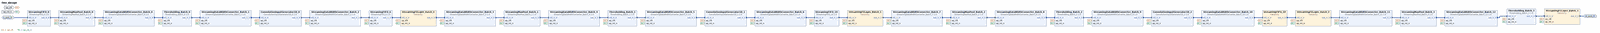
[diagram p0: block diagram of the top level, whole]
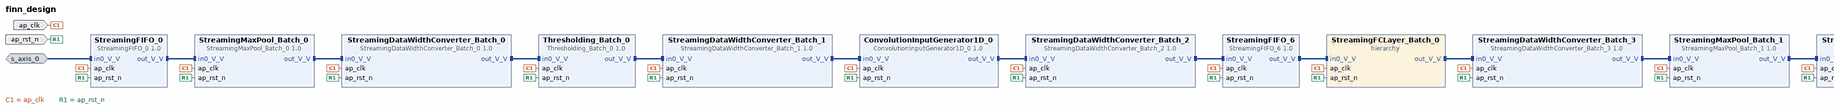
[diagram p1: block diagram of the top level, left part]
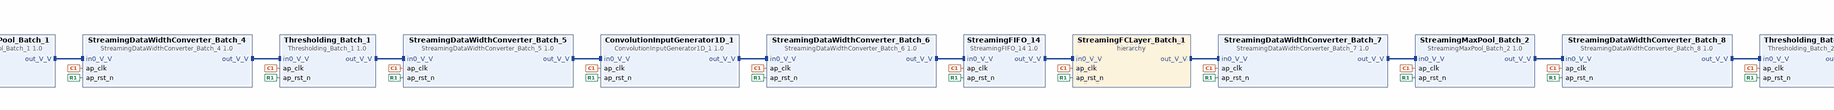
[diagram p2: block diagram of the top level, centre part]
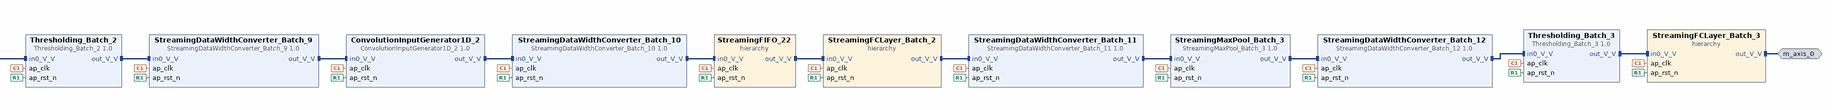
[diagram p3: block diagram of the top level, right part]
# Vivado block design finn_design, xc7z020clg400-1, Vivado 2019.1
create_bd_design finn_design

create_bd_intf_port -mode Slave -vlnv xilinx.com:interface:axis_rtl:1.0 s_axis_0
set_property -dict [list \
  CONFIG.FREQ_HZ 100000000.000000 \
  CONFIG.HAS_TKEEP 0 \
  CONFIG.HAS_TLAST 0 \
  CONFIG.HAS_TREADY 1 \
  CONFIG.HAS_TSTRB 0 \
  CONFIG.LAYERED_METADATA undef \
  CONFIG.TDATA_NUM_BYTES 25 \
  CONFIG.TDEST_WIDTH 0 \
  CONFIG.TID_WIDTH 0 \
  CONFIG.TUSER_WIDTH 0 \
] [get_bd_intf_ports s_axis_0]
create_bd_intf_port -mode Master -vlnv xilinx.com:interface:axis_rtl:1.0 m_axis_0
set_property -dict {CONFIG.FREQ_HZ 100000000.000000} [get_bd_intf_ports m_axis_0]
create_bd_port -dir I -type clk ap_clk
set_property -dict {CONFIG.FREQ_HZ 100000000.000000} [get_bd_ports ap_clk]
create_bd_port -dir I -type rst ap_rst_n

create_bd_cell -type ip -vlnv xilinx.com:hls:StreamingFIFO_0:1.0 StreamingFIFO_0
create_bd_cell -type ip -vlnv xilinx.com:hls:StreamingMaxPool_Batch_0:1.0 StreamingMaxPool_Batch_0
create_bd_cell -type ip -vlnv xilinx.com:hls:StreamingDataWidthConverter_Batch_0:1.0 StreamingDataWidthConverter_Batch_0
create_bd_cell -type ip -vlnv xilinx.com:hls:Thresholding_Batch_0:1.0 Thresholding_Batch_0
create_bd_cell -type ip -vlnv xilinx.com:hls:StreamingDataWidthConverter_Batch_1:1.0 StreamingDataWidthConverter_Batch_1
create_bd_cell -type ip -vlnv xilinx.com:hls:ConvolutionInputGenerator1D_0:1.0 ConvolutionInputGenerator1D_0
create_bd_cell -type ip -vlnv xilinx.com:hls:StreamingDataWidthConverter_Batch_2:1.0 StreamingDataWidthConverter_Batch_2
create_bd_cell -type ip -vlnv xilinx.com:hls:StreamingFIFO_6:1.0 StreamingFIFO_6
create_bd_cell -type hier StreamingFCLayer_Batch_0
create_bd_cell -type ip -vlnv xilinx.com:hls:StreamingDataWidthConverter_Batch_3:1.0 StreamingDataWidthConverter_Batch_3
create_bd_cell -type ip -vlnv xilinx.com:hls:StreamingMaxPool_Batch_1:1.0 StreamingMaxPool_Batch_1
create_bd_cell -type ip -vlnv xilinx.com:hls:StreamingDataWidthConverter_Batch_4:1.0 StreamingDataWidthConverter_Batch_4
create_bd_cell -type ip -vlnv xilinx.com:hls:Thresholding_Batch_1:1.0 Thresholding_Batch_1
create_bd_cell -type ip -vlnv xilinx.com:hls:StreamingDataWidthConverter_Batch_5:1.0 StreamingDataWidthConverter_Batch_5
create_bd_cell -type ip -vlnv xilinx.com:hls:ConvolutionInputGenerator1D_1:1.0 ConvolutionInputGenerator1D_1
create_bd_cell -type ip -vlnv xilinx.com:hls:StreamingDataWidthConverter_Batch_6:1.0 StreamingDataWidthConverter_Batch_6
create_bd_cell -type ip -vlnv xilinx.com:hls:StreamingFIFO_14:1.0 StreamingFIFO_14
create_bd_cell -type hier StreamingFCLayer_Batch_1
create_bd_cell -type ip -vlnv xilinx.com:hls:StreamingDataWidthConverter_Batch_7:1.0 StreamingDataWidthConverter_Batch_7
create_bd_cell -type ip -vlnv xilinx.com:hls:StreamingMaxPool_Batch_2:1.0 StreamingMaxPool_Batch_2
create_bd_cell -type ip -vlnv xilinx.com:hls:StreamingDataWidthConverter_Batch_8:1.0 StreamingDataWidthConverter_Batch_8
create_bd_cell -type ip -vlnv xilinx.com:hls:Thresholding_Batch_2:1.0 Thresholding_Batch_2
create_bd_cell -type ip -vlnv xilinx.com:hls:StreamingDataWidthConverter_Batch_9:1.0 StreamingDataWidthConverter_Batch_9
create_bd_cell -type ip -vlnv xilinx.com:hls:ConvolutionInputGenerator1D_2:1.0 ConvolutionInputGenerator1D_2
create_bd_cell -type ip -vlnv xilinx.com:hls:StreamingDataWidthConverter_Batch_10:1.0 StreamingDataWidthConverter_Batch_10
create_bd_cell -type hier StreamingFIFO_22
create_bd_cell -type hier StreamingFCLayer_Batch_2
create_bd_cell -type ip -vlnv xilinx.com:hls:StreamingDataWidthConverter_Batch_11:1.0 StreamingDataWidthConverter_Batch_11
create_bd_cell -type ip -vlnv xilinx.com:hls:StreamingMaxPool_Batch_3:1.0 StreamingMaxPool_Batch_3
create_bd_cell -type ip -vlnv xilinx.com:hls:StreamingDataWidthConverter_Batch_12:1.0 StreamingDataWidthConverter_Batch_12
create_bd_cell -type ip -vlnv xilinx.com:hls:Thresholding_Batch_3:1.0 Thresholding_Batch_3
create_bd_cell -type hier StreamingFCLayer_Batch_3

# ---- hierarchy /StreamingFCLayer_Batch_0 ----
current_bd_instance /StreamingFCLayer_Batch_0
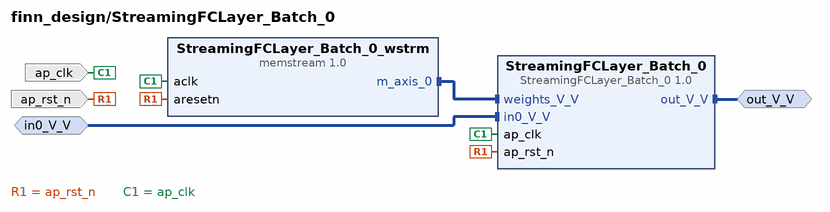
[diagram p4: block diagram inside /StreamingFCLayer_Batch_0]
create_bd_intf_pin -mode Master -vlnv xilinx.com:interface:axis_rtl:1.0 out_V_V
create_bd_intf_pin -mode Slave -vlnv xilinx.com:interface:axis_rtl:1.0 in0_V_V
create_bd_pin -dir I -type clk ap_clk
create_bd_pin -dir I -type rst ap_rst_n

create_bd_cell -type ip -vlnv xilinx.com:hls:StreamingFCLayer_Batch_0:1.0 StreamingFCLayer_Batch_0
create_bd_cell -type ip -vlnv xilinx.com:user:memstream:1.0 StreamingFCLayer_Batch_0_wstrm
set_property -dict [list \
  CONFIG.MEM_DEPTH 250 \
  CONFIG.MEM_INIT {/tmp/finn_dev_floodd1@ad.mee.tcd.ie/code_gen_ipgen_StreamingFCLayer_Batch_0_yrzn1xqf/} \
  CONFIG.MEM_WIDTH 360 \
  CONFIG.NSTREAMS 1 \
  CONFIG.RAM_STYLE auto \
  CONFIG.STRM0_DEPTH 250 \
  CONFIG.STRM0_OFFSET 0 \
  CONFIG.STRM0_WIDTH 360 \
] [get_bd_cells StreamingFCLayer_Batch_0_wstrm]

# ---- hierarchy /StreamingFCLayer_Batch_1 ----
current_bd_instance /StreamingFCLayer_Batch_1
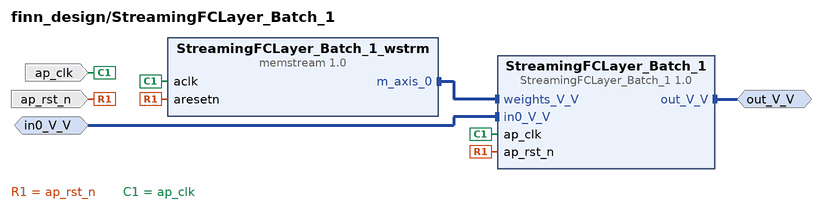
[diagram p5: block diagram inside /StreamingFCLayer_Batch_1]
create_bd_intf_pin -mode Master -vlnv xilinx.com:interface:axis_rtl:1.0 out_V_V
create_bd_intf_pin -mode Slave -vlnv xilinx.com:interface:axis_rtl:1.0 in0_V_V
create_bd_pin -dir I -type clk ap_clk
create_bd_pin -dir I -type rst ap_rst_n

create_bd_cell -type ip -vlnv xilinx.com:hls:StreamingFCLayer_Batch_1:1.0 StreamingFCLayer_Batch_1
create_bd_cell -type ip -vlnv xilinx.com:user:memstream:1.0 StreamingFCLayer_Batch_1_wstrm
set_property -dict [list \
  CONFIG.MEM_DEPTH 1125 \
  CONFIG.MEM_INIT {/tmp/finn_dev_floodd1@ad.mee.tcd.ie/code_gen_ipgen_StreamingFCLayer_Batch_1_5eper8a6/} \
  CONFIG.MEM_WIDTH 320 \
  CONFIG.NSTREAMS 1 \
  CONFIG.RAM_STYLE auto \
  CONFIG.STRM0_DEPTH 1125 \
  CONFIG.STRM0_OFFSET 0 \
  CONFIG.STRM0_WIDTH 320 \
] [get_bd_cells StreamingFCLayer_Batch_1_wstrm]

# ---- hierarchy /StreamingFIFO_22 ----
current_bd_instance /StreamingFIFO_22
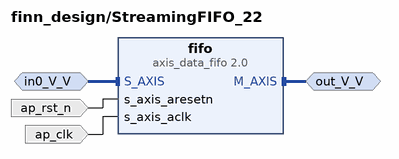
[diagram p6: block diagram inside /StreamingFIFO_22]
create_bd_intf_pin -mode Master -vlnv xilinx.com:interface:axis_rtl:1.0 out_V_V
create_bd_intf_pin -mode Slave -vlnv xilinx.com:interface:axis_rtl:1.0 in0_V_V
create_bd_pin -dir I -type clk ap_clk
create_bd_pin -dir I -type rst ap_rst_n

create_bd_cell -type ip -vlnv xilinx.com:ip:axis_data_fifo:2.0 fifo
set_property -dict {CONFIG.FIFO_DEPTH 512 CONFIG.FIFO_MEMORY_TYPE auto CONFIG.TDATA_NUM_BYTES 10} [get_bd_cells fifo]

# ---- hierarchy /StreamingFCLayer_Batch_2 ----
current_bd_instance /StreamingFCLayer_Batch_2
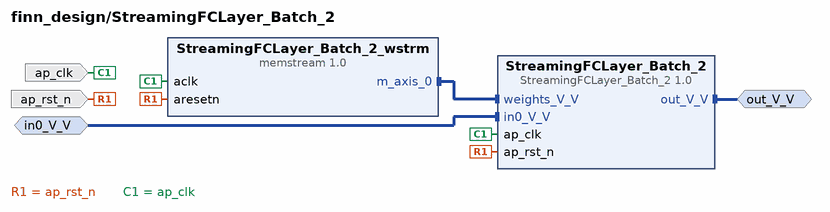
[diagram p7: block diagram inside /StreamingFCLayer_Batch_2]
create_bd_intf_pin -mode Master -vlnv xilinx.com:interface:axis_rtl:1.0 out_V_V
create_bd_intf_pin -mode Slave -vlnv xilinx.com:interface:axis_rtl:1.0 in0_V_V
create_bd_pin -dir I -type clk ap_clk
create_bd_pin -dir I -type rst ap_rst_n

create_bd_cell -type ip -vlnv xilinx.com:hls:StreamingFCLayer_Batch_2:1.0 StreamingFCLayer_Batch_2
create_bd_cell -type ip -vlnv xilinx.com:user:memstream:1.0 StreamingFCLayer_Batch_2_wstrm
set_property -dict [list \
  CONFIG.MEM_DEPTH 18000 \
  CONFIG.MEM_INIT {/tmp/finn_dev_floodd1@ad.mee.tcd.ie/code_gen_ipgen_StreamingFCLayer_Batch_2_8uay9h4c/} \
  CONFIG.MEM_WIDTH 80 \
  CONFIG.NSTREAMS 1 \
  CONFIG.RAM_STYLE auto \
  CONFIG.STRM0_DEPTH 18000 \
  CONFIG.STRM0_OFFSET 0 \
  CONFIG.STRM0_WIDTH 80 \
] [get_bd_cells StreamingFCLayer_Batch_2_wstrm]

# ---- hierarchy /StreamingFCLayer_Batch_3 ----
current_bd_instance /StreamingFCLayer_Batch_3
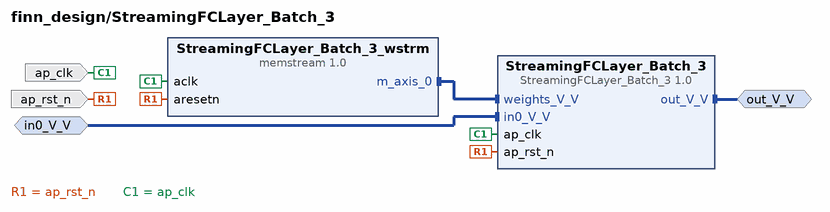
[diagram p8: block diagram inside /StreamingFCLayer_Batch_3]
create_bd_intf_pin -mode Master -vlnv xilinx.com:interface:axis_rtl:1.0 out_V_V
create_bd_intf_pin -mode Slave -vlnv xilinx.com:interface:axis_rtl:1.0 in0_V_V
create_bd_pin -dir I -type clk ap_clk
create_bd_pin -dir I -type rst ap_rst_n

create_bd_cell -type ip -vlnv xilinx.com:hls:StreamingFCLayer_Batch_3:1.0 StreamingFCLayer_Batch_3
create_bd_cell -type ip -vlnv xilinx.com:user:memstream:1.0 StreamingFCLayer_Batch_3_wstrm
set_property -dict [list \
  CONFIG.MEM_DEPTH 200 \
  CONFIG.MEM_INIT {/tmp/finn_dev_floodd1@ad.mee.tcd.ie/code_gen_ipgen_StreamingFCLayer_Batch_3_cpz_29h1/} \
  CONFIG.MEM_WIDTH 8 \
  CONFIG.NSTREAMS 1 \
  CONFIG.RAM_STYLE auto \
  CONFIG.STRM0_DEPTH 200 \
  CONFIG.STRM0_OFFSET 0 \
  CONFIG.STRM0_WIDTH 8 \
] [get_bd_cells StreamingFCLayer_Batch_3_wstrm]

# ---- connections ----

current_bd_instance /StreamingFCLayer_Batch_0
connect_bd_intf_net [get_bd_intf_pins StreamingFCLayer_Batch_0_wstrm/m_axis_0] [get_bd_intf_pins StreamingFCLayer_Batch_0/weights_V_V]
connect_bd_intf_net [get_bd_intf_pins out_V_V] [get_bd_intf_pins StreamingFCLayer_Batch_0/out_V_V]
connect_bd_intf_net [get_bd_intf_pins in0_V_V] [get_bd_intf_pins StreamingFCLayer_Batch_0/in0_V_V]
connect_bd_net [get_bd_pins ap_rst_n] [get_bd_pins StreamingFCLayer_Batch_0_wstrm/aresetn] [get_bd_pins StreamingFCLayer_Batch_0/ap_rst_n]
connect_bd_net [get_bd_pins ap_clk] [get_bd_pins StreamingFCLayer_Batch_0_wstrm/aclk] [get_bd_pins StreamingFCLayer_Batch_0/ap_clk]

current_bd_instance /StreamingFCLayer_Batch_1
connect_bd_intf_net [get_bd_intf_pins StreamingFCLayer_Batch_1_wstrm/m_axis_0] [get_bd_intf_pins StreamingFCLayer_Batch_1/weights_V_V]
connect_bd_intf_net [get_bd_intf_pins in0_V_V] [get_bd_intf_pins StreamingFCLayer_Batch_1/in0_V_V]
connect_bd_intf_net [get_bd_intf_pins out_V_V] [get_bd_intf_pins StreamingFCLayer_Batch_1/out_V_V]
connect_bd_net [get_bd_pins ap_rst_n] [get_bd_pins StreamingFCLayer_Batch_1_wstrm/aresetn] [get_bd_pins StreamingFCLayer_Batch_1/ap_rst_n]
connect_bd_net [get_bd_pins ap_clk] [get_bd_pins StreamingFCLayer_Batch_1_wstrm/aclk] [get_bd_pins StreamingFCLayer_Batch_1/ap_clk]

current_bd_instance /StreamingFIFO_22
connect_bd_intf_net [get_bd_intf_pins in0_V_V] [get_bd_intf_pins fifo/S_AXIS]
connect_bd_intf_net [get_bd_intf_pins out_V_V] [get_bd_intf_pins fifo/M_AXIS]
connect_bd_net [get_bd_pins ap_rst_n] [get_bd_pins fifo/s_axis_aresetn]
connect_bd_net [get_bd_pins ap_clk] [get_bd_pins fifo/s_axis_aclk]

current_bd_instance /StreamingFCLayer_Batch_2
connect_bd_intf_net [get_bd_intf_pins StreamingFCLayer_Batch_2_wstrm/m_axis_0] [get_bd_intf_pins StreamingFCLayer_Batch_2/weights_V_V]
connect_bd_intf_net [get_bd_intf_pins in0_V_V] [get_bd_intf_pins StreamingFCLayer_Batch_2/in0_V_V]
connect_bd_intf_net [get_bd_intf_pins out_V_V] [get_bd_intf_pins StreamingFCLayer_Batch_2/out_V_V]
connect_bd_net [get_bd_pins ap_rst_n] [get_bd_pins StreamingFCLayer_Batch_2_wstrm/aresetn] [get_bd_pins StreamingFCLayer_Batch_2/ap_rst_n]
connect_bd_net [get_bd_pins ap_clk] [get_bd_pins StreamingFCLayer_Batch_2_wstrm/aclk] [get_bd_pins StreamingFCLayer_Batch_2/ap_clk]

current_bd_instance /StreamingFCLayer_Batch_3
connect_bd_intf_net [get_bd_intf_pins StreamingFCLayer_Batch_3_wstrm/m_axis_0] [get_bd_intf_pins StreamingFCLayer_Batch_3/weights_V_V]
connect_bd_intf_net [get_bd_intf_pins in0_V_V] [get_bd_intf_pins StreamingFCLayer_Batch_3/in0_V_V]
connect_bd_intf_net [get_bd_intf_pins out_V_V] [get_bd_intf_pins StreamingFCLayer_Batch_3/out_V_V]
connect_bd_net [get_bd_pins ap_rst_n] [get_bd_pins StreamingFCLayer_Batch_3_wstrm/aresetn] [get_bd_pins StreamingFCLayer_Batch_3/ap_rst_n]
connect_bd_net [get_bd_pins ap_clk] [get_bd_pins StreamingFCLayer_Batch_3_wstrm/aclk] [get_bd_pins StreamingFCLayer_Batch_3/ap_clk]

current_bd_instance /
connect_bd_intf_net [get_bd_intf_pins StreamingDataWidthConverter_Batch_3/out_V_V] [get_bd_intf_pins StreamingMaxPool_Batch_1/in0_V_V]
connect_bd_intf_net [get_bd_intf_pins StreamingMaxPool_Batch_1/out_V_V] [get_bd_intf_pins StreamingDataWidthConverter_Batch_4/in0_V_V]
connect_bd_intf_net [get_bd_intf_pins Thresholding_Batch_1/out_V_V] [get_bd_intf_pins StreamingDataWidthConverter_Batch_5/in0_V_V]
connect_bd_intf_net [get_bd_intf_pins StreamingDataWidthConverter_Batch_7/out_V_V] [get_bd_intf_pins StreamingMaxPool_Batch_2/in0_V_V]
connect_bd_intf_net [get_bd_intf_pins StreamingDataWidthConverter_Batch_9/out_V_V] [get_bd_intf_pins ConvolutionInputGenerator1D_2/in0_V_V]
connect_bd_intf_net [get_bd_intf_pins StreamingFCLayer_Batch_2/out_V_V] [get_bd_intf_pins StreamingDataWidthConverter_Batch_11/in0_V_V]
connect_bd_intf_net [get_bd_intf_pins Thresholding_Batch_2/out_V_V] [get_bd_intf_pins StreamingDataWidthConverter_Batch_9/in0_V_V]
connect_bd_intf_net [get_bd_intf_pins StreamingFIFO_22/out_V_V] [get_bd_intf_pins StreamingFCLayer_Batch_2/in0_V_V]
connect_bd_intf_net [get_bd_intf_pins StreamingDataWidthConverter_Batch_2/out_V_V] [get_bd_intf_pins StreamingFIFO_6/in0_V_V]
connect_bd_intf_net [get_bd_intf_pins StreamingDataWidthConverter_Batch_12/out_V_V] [get_bd_intf_pins Thresholding_Batch_3/in0_V_V]
connect_bd_intf_net [get_bd_intf_pins StreamingDataWidthConverter_Batch_1/out_V_V] [get_bd_intf_pins ConvolutionInputGenerator1D_0/in0_V_V]
connect_bd_intf_net [get_bd_intf_pins Thresholding_Batch_0/out_V_V] [get_bd_intf_pins StreamingDataWidthConverter_Batch_1/in0_V_V]
connect_bd_intf_net [get_bd_intf_pins StreamingDataWidthConverter_Batch_4/out_V_V] [get_bd_intf_pins Thresholding_Batch_1/in0_V_V]
connect_bd_intf_net [get_bd_intf_pins StreamingDataWidthConverter_Batch_5/out_V_V] [get_bd_intf_pins ConvolutionInputGenerator1D_1/in0_V_V]
connect_bd_intf_net [get_bd_intf_pins StreamingFIFO_0/out_V_V] [get_bd_intf_pins StreamingMaxPool_Batch_0/in0_V_V]
connect_bd_intf_net [get_bd_intf_pins StreamingFCLayer_Batch_1/out_V_V] [get_bd_intf_pins StreamingDataWidthConverter_Batch_7/in0_V_V]
connect_bd_intf_net [get_bd_intf_pins ConvolutionInputGenerator1D_2/out_V_V] [get_bd_intf_pins StreamingDataWidthConverter_Batch_10/in0_V_V]
connect_bd_intf_net [get_bd_intf_pins StreamingFCLayer_Batch_0/out_V_V] [get_bd_intf_pins StreamingDataWidthConverter_Batch_3/in0_V_V]
connect_bd_intf_net [get_bd_intf_pins StreamingDataWidthConverter_Batch_10/out_V_V] [get_bd_intf_pins StreamingFIFO_22/in0_V_V]
connect_bd_intf_net [get_bd_intf_pins StreamingDataWidthConverter_Batch_8/out_V_V] [get_bd_intf_pins Thresholding_Batch_2/in0_V_V]
connect_bd_intf_net [get_bd_intf_pins StreamingFIFO_6/out_V_V] [get_bd_intf_pins StreamingFCLayer_Batch_0/in0_V_V]
connect_bd_intf_net [get_bd_intf_pins StreamingDataWidthConverter_Batch_11/out_V_V] [get_bd_intf_pins StreamingMaxPool_Batch_3/in0_V_V]
connect_bd_intf_net [get_bd_intf_ports m_axis_0] [get_bd_intf_pins StreamingFCLayer_Batch_3/out_V_V]
connect_bd_intf_net [get_bd_intf_pins StreamingDataWidthConverter_Batch_6/out_V_V] [get_bd_intf_pins StreamingFIFO_14/in0_V_V]
connect_bd_intf_net [get_bd_intf_pins ConvolutionInputGenerator1D_0/out_V_V] [get_bd_intf_pins StreamingDataWidthConverter_Batch_2/in0_V_V]
connect_bd_intf_net [get_bd_intf_pins StreamingMaxPool_Batch_2/out_V_V] [get_bd_intf_pins StreamingDataWidthConverter_Batch_8/in0_V_V]
connect_bd_intf_net [get_bd_intf_pins StreamingMaxPool_Batch_0/out_V_V] [get_bd_intf_pins StreamingDataWidthConverter_Batch_0/in0_V_V]
connect_bd_intf_net [get_bd_intf_pins Thresholding_Batch_3/out_V_V] [get_bd_intf_pins StreamingFCLayer_Batch_3/in0_V_V]
connect_bd_intf_net [get_bd_intf_pins StreamingDataWidthConverter_Batch_0/out_V_V] [get_bd_intf_pins Thresholding_Batch_0/in0_V_V]
connect_bd_intf_net [get_bd_intf_pins StreamingMaxPool_Batch_3/out_V_V] [get_bd_intf_pins StreamingDataWidthConverter_Batch_12/in0_V_V]
connect_bd_intf_net [get_bd_intf_pins ConvolutionInputGenerator1D_1/out_V_V] [get_bd_intf_pins StreamingDataWidthConverter_Batch_6/in0_V_V]
connect_bd_intf_net -intf_net in0_V_V_0_1 [get_bd_intf_ports s_axis_0] [get_bd_intf_pins StreamingFIFO_0/in0_V_V]
connect_bd_intf_net [get_bd_intf_pins StreamingFIFO_14/out_V_V] [get_bd_intf_pins StreamingFCLayer_Batch_1/in0_V_V]
connect_bd_net -net ap_clk_0_1 [get_bd_ports ap_clk] \
  [get_bd_pins StreamingFIFO_0/ap_clk] [get_bd_pins StreamingMaxPool_Batch_0/ap_clk] \
  [get_bd_pins StreamingDataWidthConverter_Batch_0/ap_clk] [get_bd_pins Thresholding_Batch_0/ap_clk] \
  [get_bd_pins StreamingDataWidthConverter_Batch_1/ap_clk] [get_bd_pins ConvolutionInputGenerator1D_0/ap_clk] \
  [get_bd_pins StreamingDataWidthConverter_Batch_2/ap_clk] [get_bd_pins StreamingFIFO_6/ap_clk] \
  [get_bd_pins StreamingFCLayer_Batch_0/ap_clk] [get_bd_pins StreamingDataWidthConverter_Batch_3/ap_clk] \
  [get_bd_pins StreamingMaxPool_Batch_1/ap_clk] [get_bd_pins StreamingDataWidthConverter_Batch_4/ap_clk] \
  [get_bd_pins Thresholding_Batch_1/ap_clk] [get_bd_pins StreamingDataWidthConverter_Batch_5/ap_clk] \
  [get_bd_pins ConvolutionInputGenerator1D_1/ap_clk] [get_bd_pins StreamingDataWidthConverter_Batch_6/ap_clk] \
  [get_bd_pins StreamingFIFO_14/ap_clk] [get_bd_pins StreamingFCLayer_Batch_1/ap_clk] \
  [get_bd_pins StreamingDataWidthConverter_Batch_7/ap_clk] [get_bd_pins StreamingMaxPool_Batch_2/ap_clk] \
  [get_bd_pins StreamingDataWidthConverter_Batch_8/ap_clk] [get_bd_pins Thresholding_Batch_2/ap_clk] \
  [get_bd_pins StreamingDataWidthConverter_Batch_9/ap_clk] [get_bd_pins ConvolutionInputGenerator1D_2/ap_clk] \
  [get_bd_pins StreamingDataWidthConverter_Batch_10/ap_clk] [get_bd_pins StreamingFIFO_22/ap_clk] \
  [get_bd_pins StreamingFCLayer_Batch_2/ap_clk] [get_bd_pins StreamingDataWidthConverter_Batch_11/ap_clk] \
  [get_bd_pins StreamingMaxPool_Batch_3/ap_clk] [get_bd_pins StreamingDataWidthConverter_Batch_12/ap_clk] \
  [get_bd_pins Thresholding_Batch_3/ap_clk] [get_bd_pins StreamingFCLayer_Batch_3/ap_clk]
connect_bd_net -net ap_rst_n_0_1 [get_bd_ports ap_rst_n] \
  [get_bd_pins StreamingFIFO_0/ap_rst_n] [get_bd_pins StreamingMaxPool_Batch_0/ap_rst_n] \
  [get_bd_pins StreamingDataWidthConverter_Batch_0/ap_rst_n] [get_bd_pins Thresholding_Batch_0/ap_rst_n] \
  [get_bd_pins StreamingDataWidthConverter_Batch_1/ap_rst_n] [get_bd_pins ConvolutionInputGenerator1D_0/ap_rst_n] \
  [get_bd_pins StreamingDataWidthConverter_Batch_2/ap_rst_n] [get_bd_pins StreamingFIFO_6/ap_rst_n] \
  [get_bd_pins StreamingFCLayer_Batch_0/ap_rst_n] [get_bd_pins StreamingDataWidthConverter_Batch_3/ap_rst_n] \
  [get_bd_pins StreamingMaxPool_Batch_1/ap_rst_n] [get_bd_pins StreamingDataWidthConverter_Batch_4/ap_rst_n] \
  [get_bd_pins Thresholding_Batch_1/ap_rst_n] [get_bd_pins StreamingDataWidthConverter_Batch_5/ap_rst_n] \
  [get_bd_pins ConvolutionInputGenerator1D_1/ap_rst_n] [get_bd_pins StreamingDataWidthConverter_Batch_6/ap_rst_n] \
  [get_bd_pins StreamingFIFO_14/ap_rst_n] [get_bd_pins StreamingFCLayer_Batch_1/ap_rst_n] \
  [get_bd_pins StreamingDataWidthConverter_Batch_7/ap_rst_n] [get_bd_pins StreamingMaxPool_Batch_2/ap_rst_n] \
  [get_bd_pins StreamingDataWidthConverter_Batch_8/ap_rst_n] [get_bd_pins Thresholding_Batch_2/ap_rst_n] \
  [get_bd_pins StreamingDataWidthConverter_Batch_9/ap_rst_n] [get_bd_pins ConvolutionInputGenerator1D_2/ap_rst_n] \
  [get_bd_pins StreamingDataWidthConverter_Batch_10/ap_rst_n] [get_bd_pins StreamingFIFO_22/ap_rst_n] \
  [get_bd_pins StreamingFCLayer_Batch_2/ap_rst_n] [get_bd_pins StreamingDataWidthConverter_Batch_11/ap_rst_n] \
  [get_bd_pins StreamingMaxPool_Batch_3/ap_rst_n] [get_bd_pins StreamingDataWidthConverter_Batch_12/ap_rst_n] \
  [get_bd_pins Thresholding_Batch_3/ap_rst_n] [get_bd_pins StreamingFCLayer_Batch_3/ap_rst_n]

validate_bd_design
save_bd_design
